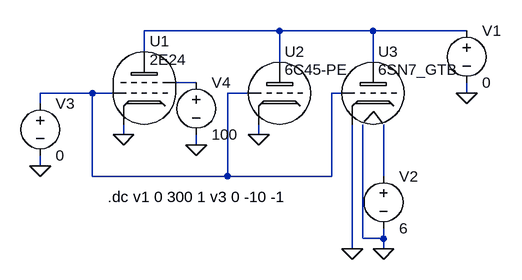
[diagram p0: schematic t_curves.asc]
t_curves.asc, the LTspice schematic file:
Version 4
SHEET 1 880 680
WIRE -224 160 -224 144
WIRE -224 256 -224 240
WIRE -144 144 -224 144
WIRE -144 272 -144 144
WIRE -112 144 -144 144
WIRE -96 208 -96 192
WIRE -64 80 -64 48
WIRE 16 128 -16 128
WIRE 16 224 16 208
WIRE 64 272 -144 272
WIRE 64 272 64 144
WIRE 96 144 64 144
WIRE 112 208 112 192
WIRE 144 48 -64 48
WIRE 144 96 144 48
WIRE 224 272 64 272
WIRE 224 272 224 144
WIRE 240 144 224 144
WIRE 256 384 256 192
WIRE 272 368 272 192
WIRE 288 48 144 48
WIRE 288 96 288 48
WIRE 304 272 304 192
WIRE 304 368 272 368
WIRE 304 368 304 352
WIRE 304 384 304 368
WIRE 432 48 288 48
WIRE 432 144 432 128
FLAG -224 256 0
FLAG -96 208 0
FLAG 112 208 0
FLAG 256 384 0
FLAG 304 384 0
FLAG 432 144 0
FLAG 16 224 0
SYMBOL voltage 432 32 R0
WINDOW 123 0 0 Left 0
WINDOW 39 0 0 Left 0
SYMATTR InstName V1
SYMATTR Value 0
SYMBOL voltage 304 256 R0
WINDOW 123 0 0 Left 0
WINDOW 39 0 0 Left 0
SYMATTR InstName V2
SYMATTR Value 6
SYMBOL voltage -224 144 R0
WINDOW 123 0 0 Left 0
WINDOW 39 0 0 Left 0
SYMATTR InstName V3
SYMATTR Value 0
SYMBOL voltage 16 112 R0
WINDOW 123 0 0 Left 0
WINDOW 39 0 0 Left 0
SYMATTR InstName V4
SYMATTR Value 100
SYMBOL Misc\\tetrode_dd -64 128 R0
WINDOW 38 8 -36 Left 0
SYMATTR InstName U1
SYMATTR SpiceModel 2E24
SYMBOL Misc\\triode_dd 144 144 R0
WINDOW 38 8 -36 Left 0
SYMATTR InstName U2
SYMATTR SpiceModel 6C45-PE
SYMBOL Misc\\triode_dd_htr 288 144 R0
WINDOW 38 8 -36 Left 0
SYMATTR InstName U3
SYMATTR SpiceModel 6SN7_GTB
TEXT -120 304 Left 0 !.dc v1 0 300 1 v3 0 -10 -1

The netlist it stands for:
* t_curves.asc
V1 N002 0 0
V2 N004 0 6
V3 N001 0 0
V4 N003 0 100
XU1 N002 N003 N001 0 2E24  ; pins Anode Screen Grid Cathode
XU2 N002 N001 0 6C45-PE  ; pins Plate Grid Cathode
XU3 N002 N001 0 0 N004 6SN7_GTB  ; pins Plate Grid Cathode H1 H2
.dc v1 0 300 1 v3 0 -10 -1
.lib tetrode.txt
.lib triode_nh.txt
.lib triode.txt
.backanno
.end